# EAGLE design Jumbo Programmer (EAGLE 7.7.0)
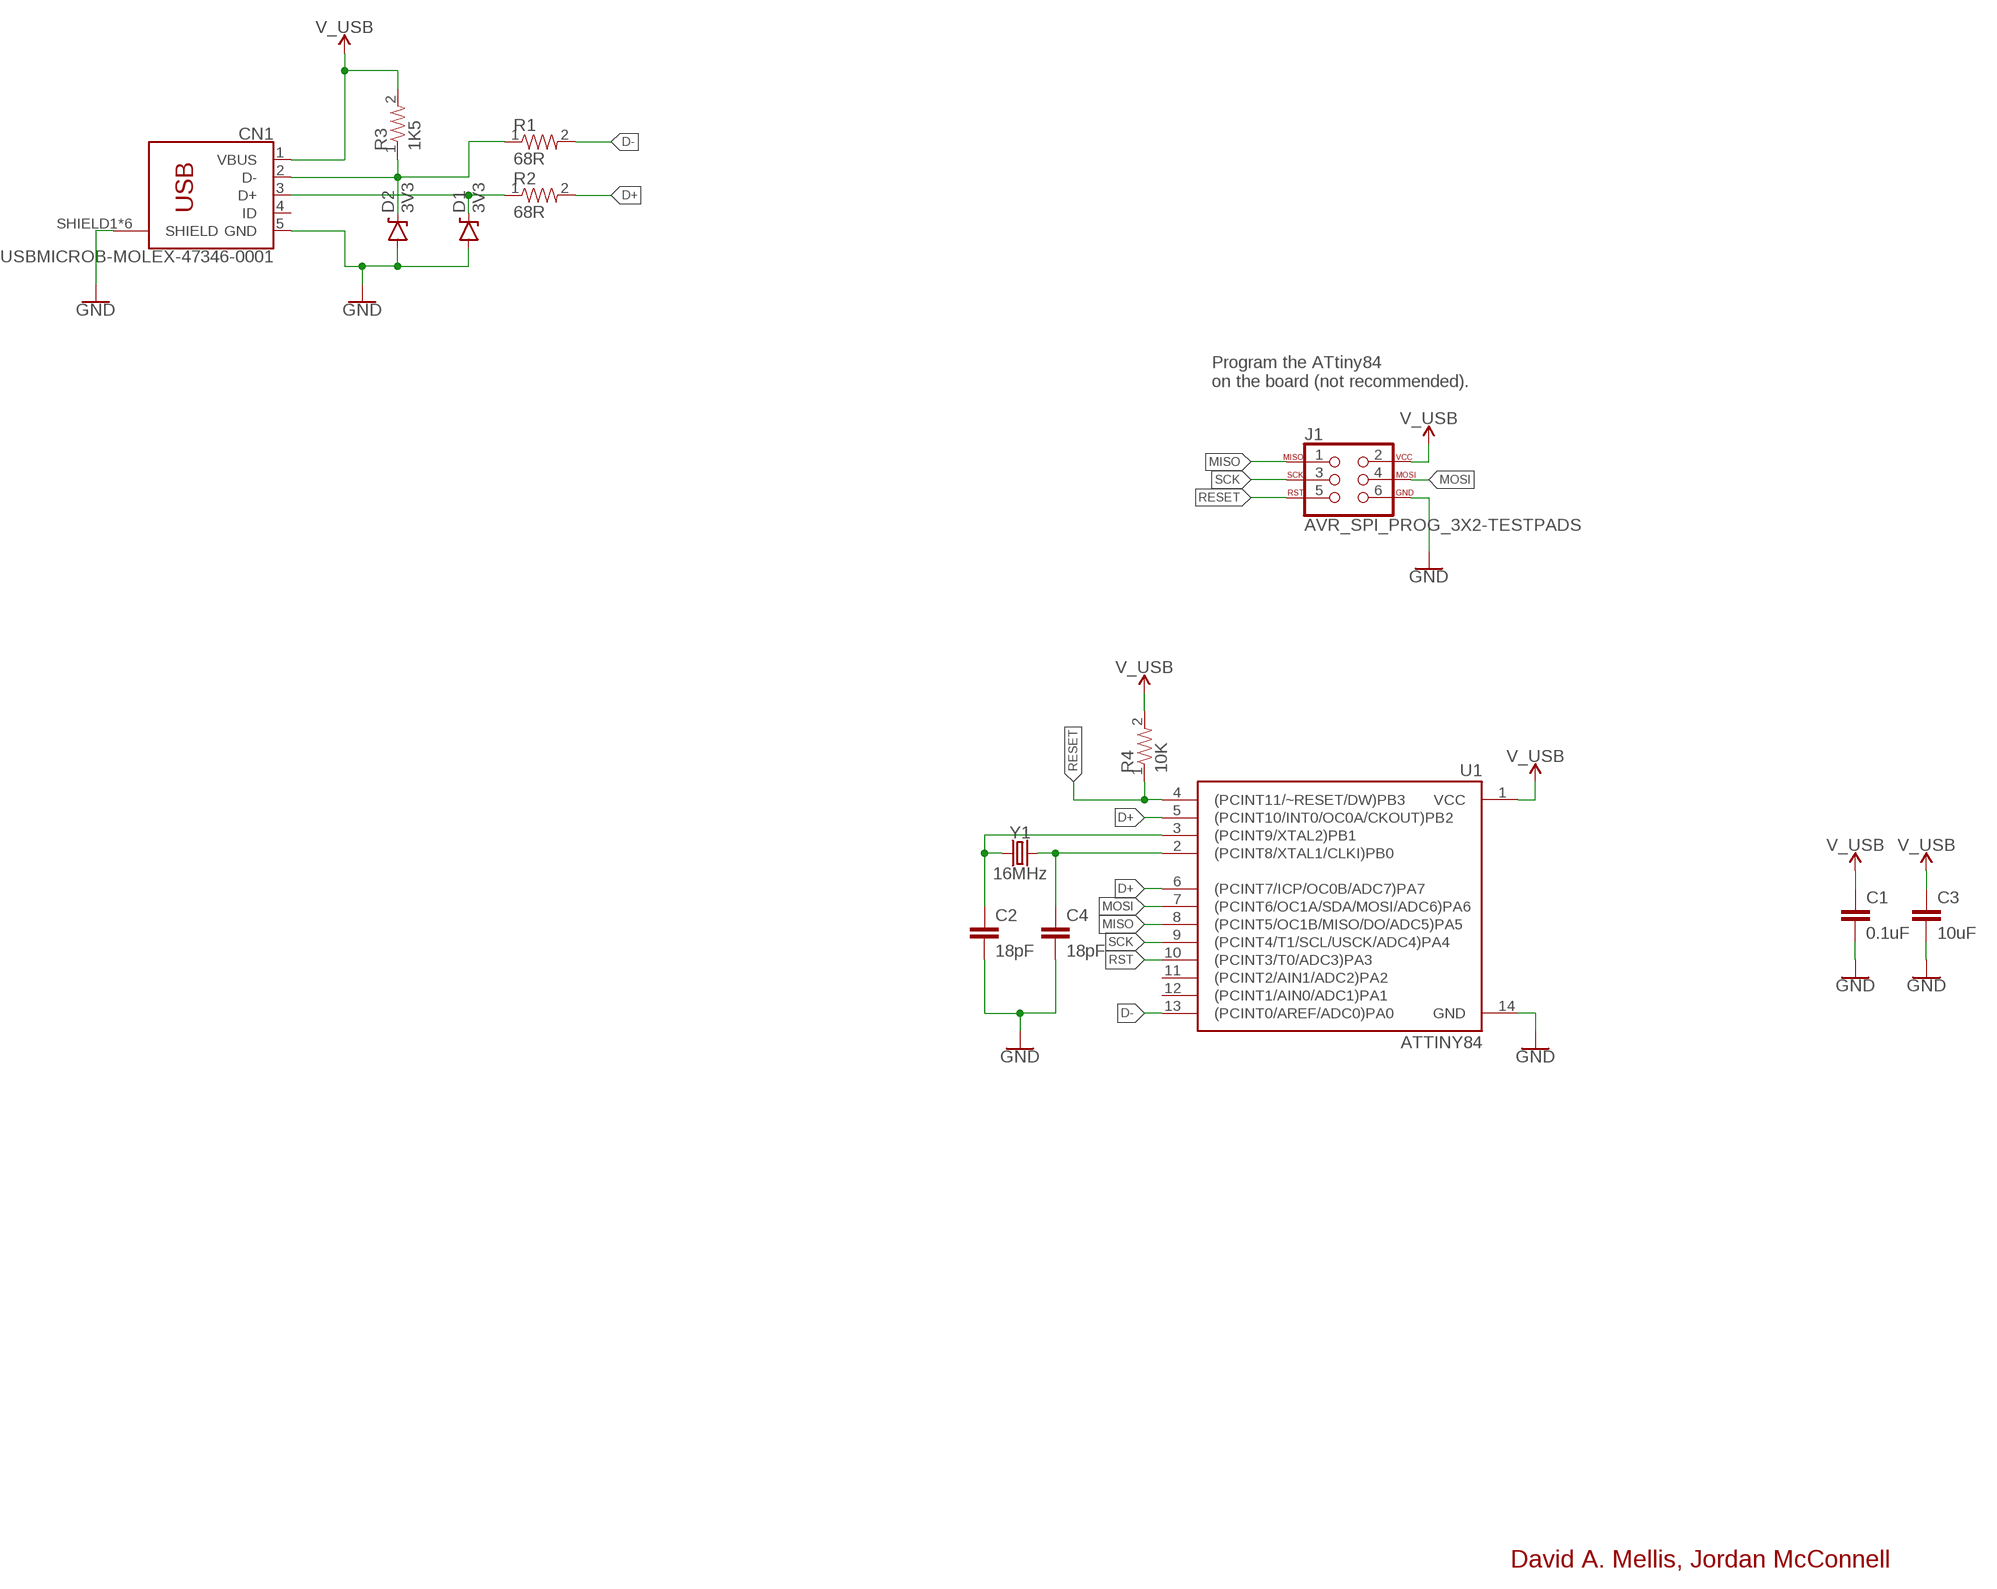
[diagram p0: schematic, sheet 1, part 1 of 2]
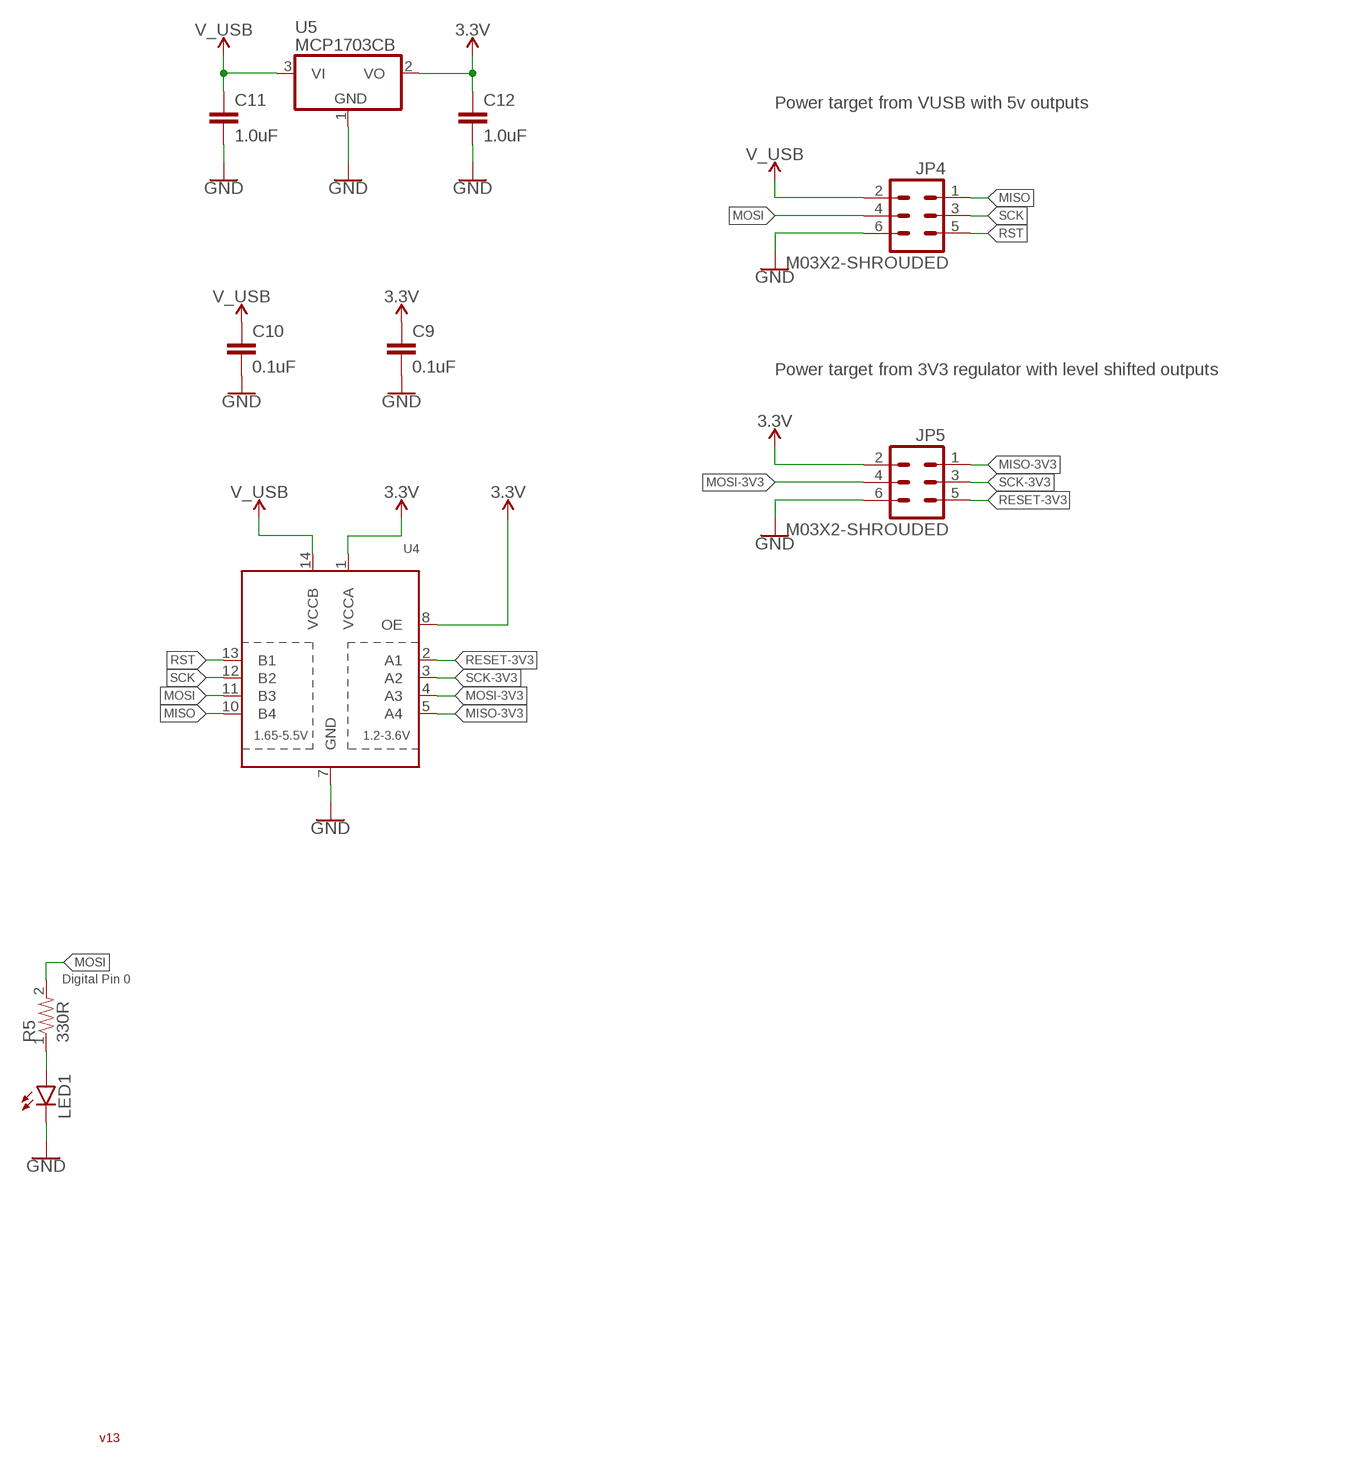
[diagram p1: schematic, sheet 1, part 2 of 2]

## Parts
C1  0.1uF  CAPACITOR-0603  [0603-CAP]
C2  18pF  CAPACITOR-0603  [0603-CAP]
C3  10uF  CAPACITOR-0603  [0603-CAP]
C4  18pF  CAPACITOR-0603  [0603-CAP]
C9  0.1uF  CAPACITOR-0603  [0603-CAP]
C10  0.1uF  CAPACITOR-0603  [0603-CAP]
C11  1.0uF  CAPACITOR-0603  [0603-CAP]
C12  1.0uF  CAPACITOR-0603  [0603-CAP]
CN1  USBMICROB-MOLEX-47346-0001  [MOLEX_47346-0001]
D1  3V3  DIODE-ZENER-SOD-323  [SOD-323]
D2  3V3  DIODE-ZENER-SOD-323  [SOD-323]
J1  AVR_SPI_PROG_3X2-TESTPADS  [2X3_TEST_PADS]
JP4  M03X2-SHROUDED  [2X3-SHROUDED-B]
JP5  M03X2-SHROUDED  [2X3-SHROUDED-B]
LED1  LED0603  [LED-0603]
R1  68R  RESISTOR-0603  [0603-RES]
R2  68R  RESISTOR-0603  [0603-RES]
R3  1K5  RESISTOR-0603  [0603-RES]
R4  10K  RESISTOR-0603  [0603-RES]
R5  330R  RESISTOR-0603  [0603-RES]
U1  ATTINY84  [SO14]
U4  TXB0104PWR  [TSSOP14]
U5  MCP1703CB  [SOT23]
Y1  16MHz  CRYSTAL-16MHZSMD-5X3.2  [CRYSTAL-SMD-5X3.2-4PAD]

## Nets
3.3V: C9.1 C12.1 JP5.2 U4.1(VCCA) U4.8(OE) U5.2(VO)
D+: R2.2 U1.5((PCINT10/INT0/OC0A/CKOUT)PB2) U1.6((PCINT7/ICP/OC0B/ADC7)PA7)
D-: R1.2 U1.13((PCINT0/AREF/ADC0)PA0)
GND: C1.2 C2.2 C3.2 C4.2 C9.2 C10.2 C11.2 C12.2 CN1.5(GND) CN1.SHIELD1(SHIELD) CN1.SHIELD2(SHIELD) CN1.SHIELD3(SHIELD) CN1.SHIELD4(SHIELD) CN1.SHIELD5(SHIELD) CN1.SHIELD6(SHIELD) D1.A D2.A J1.6 JP4.6 JP5.6 LED1.C U1.14(GND) U4.7(GND) U5.1(GND)
MISO: J1.1 JP4.1 U1.8((PCINT5/OC1B/MISO/DO/ADC5)PA5) U4.10(B4)
MISO-3V3: JP5.1 U4.5(A4)
MOSI: J1.4 JP4.4 R5.2 U1.7((PCINT6/OC1A/SDA/MOSI/ADC6)PA6) U4.11(B3)
MOSI-3V3: JP5.4 U4.4(A3)
N$1: CN1.2(D-) D2.C R1.1 R3.1
N$2: CN1.3(D+) D1.C R2.1
N$3: C2.1 U1.3((PCINT9/XTAL2)PB1) Y1.1
N$4: C4.1 U1.2((PCINT8/XTAL1/CLKI)PB0) Y1.3
N$5: LED1.A R5.1
RESET: J1.5 R4.1 U1.4((PCINT11/~RESET/DW)PB3)
RESET-3V3: JP5.5 U4.2(A1)
RST: JP4.5 U1.10((PCINT3/T0/ADC3)PA3) U4.13(B1)
SCK: J1.3 JP4.3 U1.9((PCINT4/T1/SCL/USCK/ADC4)PA4) U4.12(B2)
SCK-3V3: JP5.3 U4.3(A2)
V_USB: C1.1 C3.1 C10.1 C11.1 CN1.1(VBUS) J1.2 JP4.2 R3.2 R4.2 U1.1(VCC) U4.14(VCCB) U5.3(VI)
Unconnected: CN1.4(ID) U1.11((PCINT2/AIN1/ADC2)PA2) U1.12((PCINT1/AIN0/ADC1)PA1)

## Notes on the sheet
- Power target from VUSB with 5v outputs
- Program the ATtiny84
  on the board (not recommended).
- Power target from 3V3 regulator with level shifted outputs
- Digital Pin 0
- v13
- David A. Mellis, Jordan McConnell

## Library data of the parts
C1-C4 C9-C12 = Darryl-Capacitors:CAPACITOR: Capacitor
CN1 = Connectors:USBMICROB
D1 D2 = Darryl-DiscreteSemi:DIODE-ZENER
J1 = Connectors:AVR_SPI_PROG_3X2: AVR ISP 6 Pin This is the reduced ISP connector for AVR programming. Common on Arduino. This footprint will take up less PCB space and can be used with a 10-pin to 6-pin adapter such as SKU: BOB-08508 **Special note about "TEST_POINT" package. The stop mask is on the top side, so if you want your programming test points to be on the bottom of your board, make sure to place this package on the bottom side of the board. This also ensure that the orientation to program from the bottom side will be correct. SparkFun Products: SparkFun ISP Pogo Adapter <https://www.sparkfun.com/products/11591> - NS Tiny AVR Programmer <https://www.sparkfun.com/products/11801> -PTH
JP4 JP5 = Darryl:M03X2
LED1 = Darryl:LED: LEDs Standard schematic elements and footprints for 5mm, 3mm, 1206, and 0603 sized LEDs. 5mm - Spark Fun Electronics SKU : COM-00529 (and others)
R1-R5 = Darryl-Resistors:RESISTOR
U1 = SparkFun-DigitalIC:ATTINY84: Atmel 14-pin 2/4/8kB flash uC
U4 = adafruit:TXB0104PWR: 4-Bit Bi-Directional Level Shifter 1.2V-3.6V (VCCA) to 1.65V-5.5V (VCCB) bi-directional level shifter with auto direction sensing. Max data rate - VCCA 1.8V: 20Mbps (50ns), VCCA 3.3V: 100Mbps (10ns) Digikey: 296-21929-1-ND
U5 = linear:MCP1703: 250 mA, 16V, Low Quiescent Current LDO Regulator Source: http://ww1.microchip.com/downloads/en/DeviceDoc/22049b.pdf
Y1 = SparkFun-Clocks:CRYSTAL-16MHZ: 16MHz Crystal Digikey Example <http://www.digikey.com/product-search/en?keywords=535-9122-1-ND> Frequency: 16MHz Frequency Stability: ±50ppm Frequency Tolerance: ±20ppm Load Capacitance: 18pF SparkFun Products: Pro Micro -5V/16MHz <https://www.sparkfun.com/products/12640> SparkFun Serial Enabled LCD Kit <https://www.sparkfun.com/products/10097>; PROD_ID: XTAL-08218; SF_ID: COM-00094

## Board
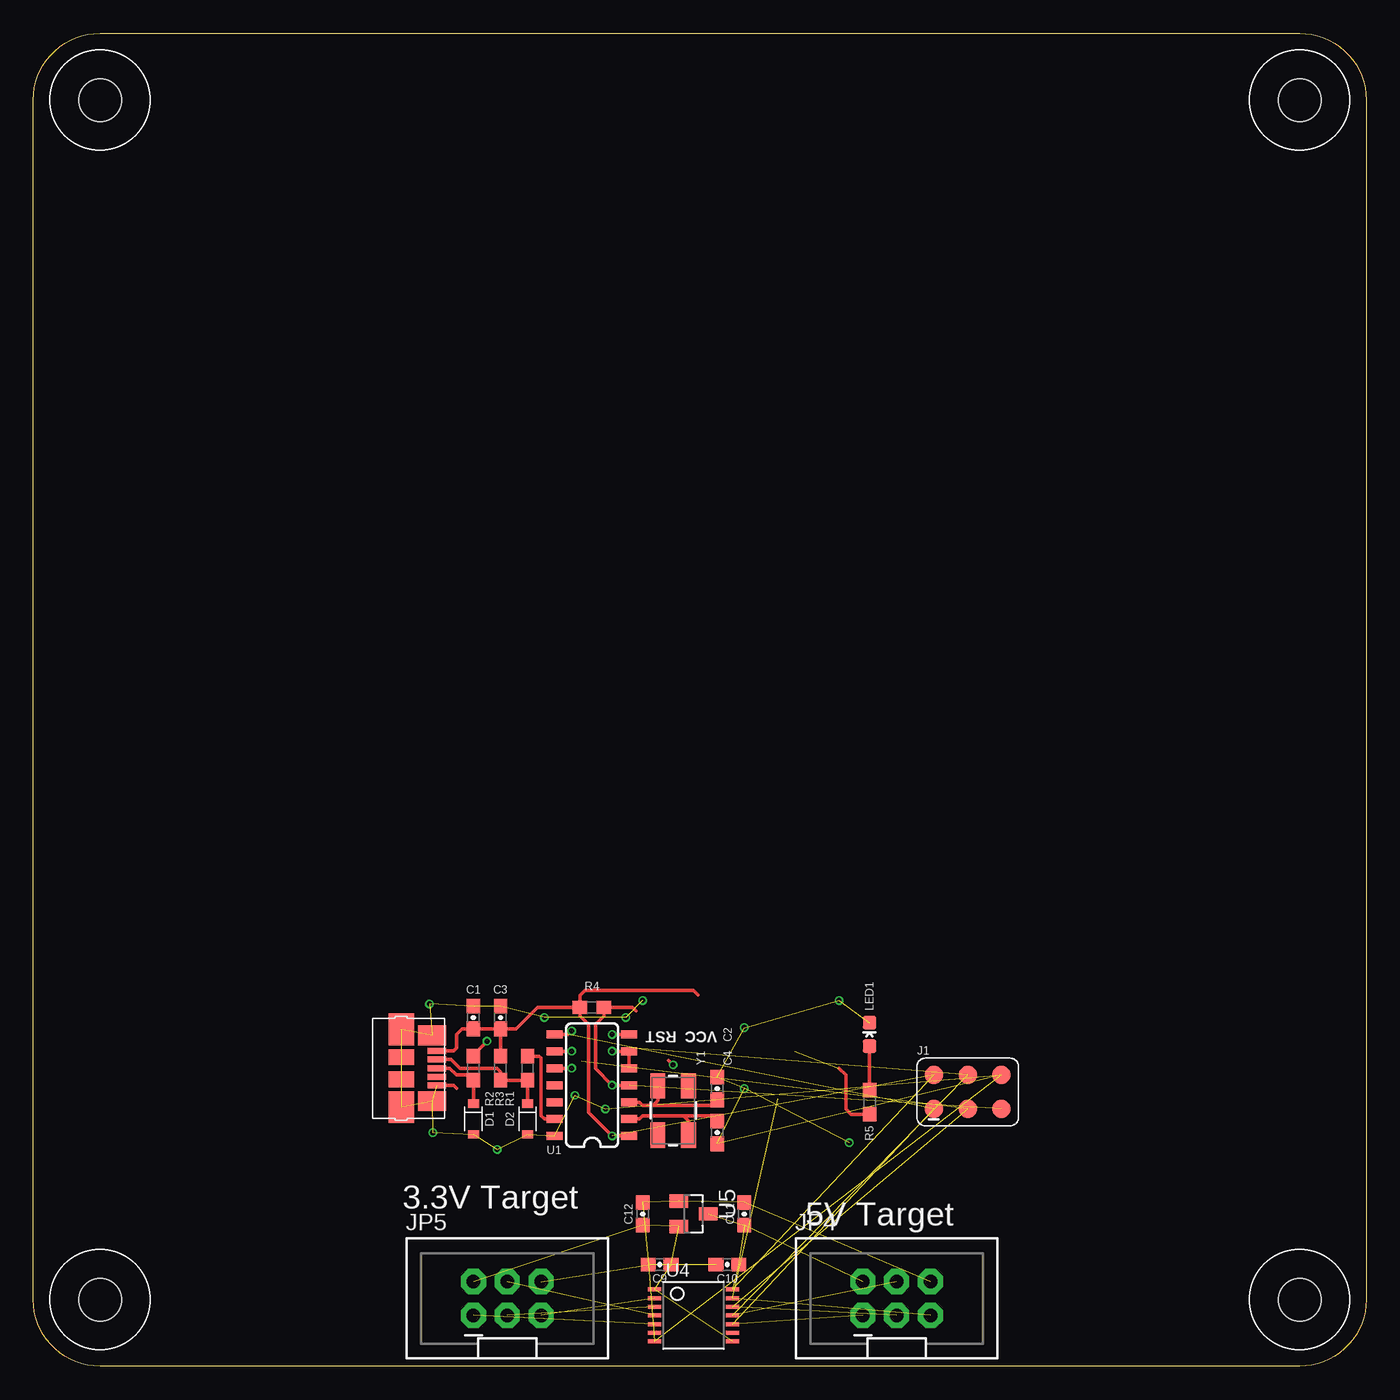
[diagram p2: board, top side]
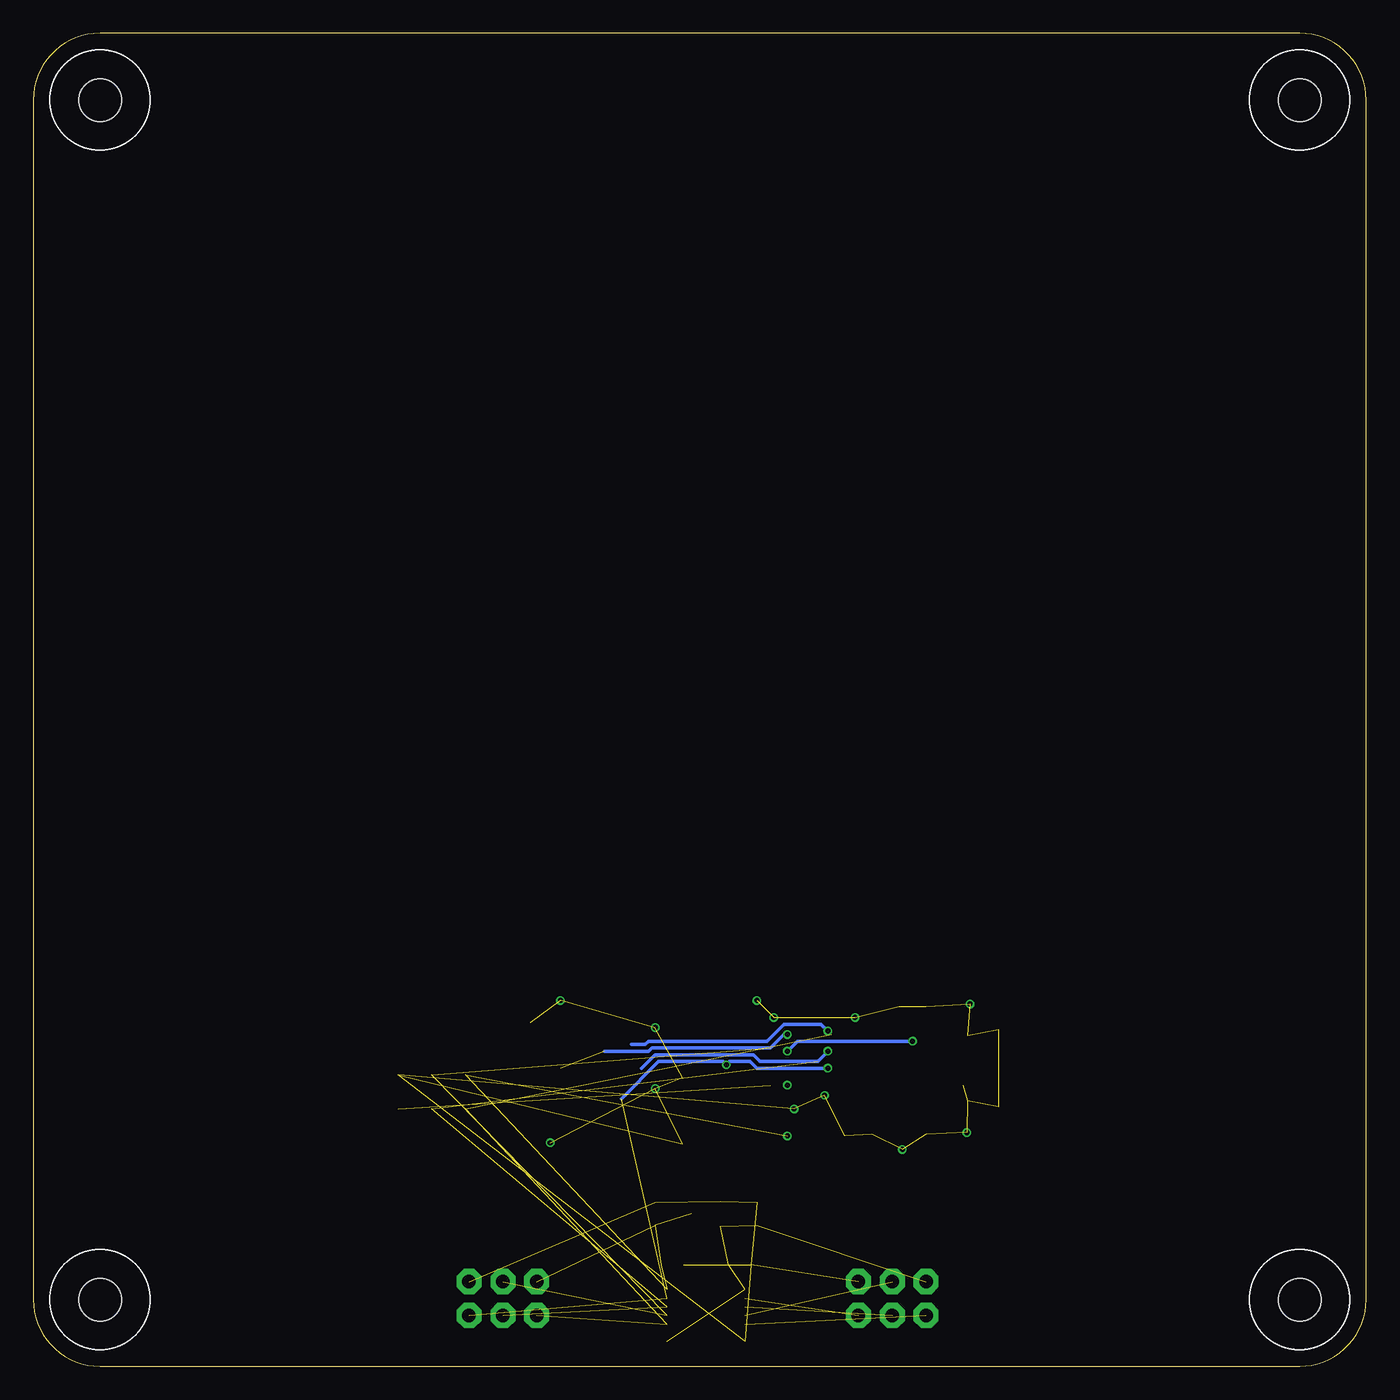
[diagram p3: board, bottom side, seen from below]

Size 100 x 100 mm. Coordinates in mm from the lower left corner, seen from the top.
Copper layers (1*16): Top 0.035559375mm / dielectric 1.6mm / Bottom 0.035559375mm
Design rules "oshpark-2layer *": minimum track width 6mil, minimum drill 10mil, track to track 6mil, track to pad 6mil, pad to pad 6mil, via to via 6mil, smd to smd 6mil, copper to edge 15mil, drill to drill 6mil, minimum pad ring 5mil, minimum via ring 5mil, stop-mask expansion 2.5mil, vias tented up to drill 20mil, thermal gap 10mil

### Footprints (pad centres in the part's own frame; a part is rotated, then mirrored left to right if it is on the bottom)
0603-CAP = smd 1.1 x 1: 1 -0.85,0; 2 0.85,0
MOLEX_47346-0001 = smd 1.38 x 0.45: 1 4.11,1.3; 2 4.11,0.65; 3 4.11,0; 4 4.11,-0.65; 5 4.11,-1.3 | smd 1.9 x 2.375: SHIELD1 1.45,2.913; SHIELD6 1.45,-2.913 | smd 2.1 x 1.475: SHIELD2 3.75,2.462; SHIELD5 3.75,-2.462 | smd 1.9 x 1.175: SHIELD3 1.45,0.838; SHIELD4 1.45,-0.838
SOD-323 = smd 0.63 x 0.83: A 1.15,0; C -1.15,0
2X3_TEST_PADS = smd 1.397 x 1.397: 1 -2.54,-1.27; 2 -2.54,1.27; 3 0,-1.27; 4 0,1.27; 5 2.54,-1.27; 6 2.54,1.27
2X3-SHROUDED-B = drill 1.016 pad 1.88 octagon: 1 -2.54,-1.27; 2 -2.54,1.27; 3 0,-1.27; 4 0,1.27; 5 2.54,-1.27; 6 2.54,1.27
LED-0603 = smd 1 x 1: A 0,-0.877; C 0,0.877
10X10CM = hole 3.2: 5,95; 95,95; 5,5; 95,5
0603-RES = smd 1.1 x 1: 1 -0.9,0; 2 0.9,0
SO14 = smd 0.6 x 1.2: 1 -3.81,-2.8; 2 -2.54,-2.8; 3 -1.27,-2.8; 4 0,-2.8; 5 1.27,-2.8; 6 2.54,-2.8; 7 3.81,-2.8; 8 3.81,2.8; 9 2.54,2.8; 10 1.27,2.8; 11 0,2.8; 12 -1.27,2.8; 13 -2.54,2.8; 14 -3.81,2.8
TSSOP14 = smd 0.305 x 0.991: 1 -1.95,-2.918; 2 -1.3,-2.918; 3 -0.65,-2.918; 4 0,-2.918; 5 0.65,-2.918; 6 1.3,-2.918; 7 1.95,-2.918; 8 1.95,2.918; 9 1.3,2.918; 10 0.65,2.918; 11 0,2.918; 12 -0.65,2.918; 13 -1.3,2.918; 14 -1.95,2.918
SOT23 = smd 1 x 1.4: 1 -0.95,-1.1; 2 0.95,-1.1; 3 0,1.1
CRYSTAL-SMD-5X3.2-4PAD = smd 1.9 x 1.1: 1 -1.85,-1.15; 2 1.85,-1.15; 3 1.85,1.15; 4 -1.85,1.15

### Placement (x,y rotation side)
C1  33.02,26.16 90 top
C2  51.31,20.83 90 top
C3  35.05,26.16 90 top
C4  51.31,17.53 270 top
C9  46.99,7.62 180 top
C10  52.07,7.62 180 top
C11  53.34,11.43 90 top
C12  45.72,11.43 90 top
CN1  26.16,22.35 0 top
D1  33.02,18.54 270 top
D2  37.08,18.54 270 top
J1  70.1,20.57 0 top
JP4  64.77,5.08 0 top
JP5  35.56,5.08 0 top
LED1  62.74,24.89 0 top
PCB1  [10X10CM]  0,0 0 top
R1  37.08,22.35 90 top
R2  33.02,22.35 90 top
R3  35.05,22.35 90 top
R4  41.91,26.92 180 top
R5  62.74,19.81 270 top
U1  41.91,21.08 90 top
U4  49.53,3.81 270 top
U5  49.53,11.43 270 top
Y1  48.01,19.18 270 top

### Tracks (layer width: path | path; a pad name or v marks a point on that pad's centre or on a via)
3.3V  (5 unrouted)
D+  (via drill 0.38)
  Top 0.254: R2.2 33.02,23.37 v34.04,24.38 | v43.43,23.62 U1.6 U1.5
  Bottom 0.254: v34.04,24.38 42.67,24.38 v43.43,23.62
D-
  Top 0.254: R1.2 37.96,23.25 38.1,23.11 38.1,18.8 38.35,18.54 U1.13
GND  (via drill 0.38)  (35 unrouted)
  Top 0.254: CN1.5 31.53,21.05 31.75,20.83
  other vias: 38.35,26.16 44.45,26.16 45.72,27.43 40.64,20.32 42.93,19.3 60.45,27.43 61.21,16.76 53.34,25.4 53.34,20.83 34.8,16.26 29.97,17.53 29.72,27.18
MISO  (via drill 0.38)  (3 unrouted)
  Top 0.254: U1.8 40.13,24.89 v40.39,25.15
  Bottom 0.254: 55.12,24.13 54.1,24.13 53.85,24.38 44.96,24.38 43.69,25.65 40.89,25.65 v40.39,25.15
MISO-3V3  (1 unrouted)
MOSI  (via drill 0.38)  (4 unrouted)
  Top 0.254: U1.7 v43.43,24.89 | R5.2 61.35,18.91 60.96,19.3 60.96,21.84 60.45,22.35
  Bottom 0.254: 57.15,23.62 53.85,23.62 53.59,23.88 44.7,23.88 43.69,24.89 v43.43,24.89
MOSI-3V3  (1 unrouted)
N$1
  Top 0.254: CN1.2 31.35,23 32,22.35 34.8,22.35 35.05,22.1 R3.1 R1.1 D2.C
N$2
  Top 0.254: D1.C R2.1 32.63,21.84 31.75,21.84 31.24,22.35 CN1.3
N$3
  Top 0.254: U1.3 45.47,19.81 45.72,19.56 46.48,19.56 | 46.48,19.56 50.89,19.56 C2.1 | Y1.1 46.86,19.93 46.48,19.56
N$4
  Top 0.254: U1.2 45.47,18.54 45.72,18.8 48.77,18.8 | 48.77,18.8 50.89,18.8 C4.1 | Y1.3 49.16,18.41 48.77,18.8
N$5
  Top 0.254: R5.1 LED1.A
RESET  (via drill 0.38)  (1 unrouted)
  Top 0.254: U1.4 v43.43,21.08 42.16,22.35 42.16,25.65 42.81,26.3 R4.1 44.96,26.92 45.21,26.67
RESET-3V3  (1 unrouted)
RST  (via drill 0.38)  (2 unrouted)
  Top 0.254: U1.10 v40.39,22.35 | 47.65,22.96 v48.01,22.61
  Bottom 0.254: 55.88,20.07 53.09,22.86 48.26,22.86 v48.01,22.61 47.75,22.86 46.23,22.86 45.72,22.35 v40.39,22.35
SCK  (via drill 0.38)  (3 unrouted)
  Top 0.254: U1.9 v40.39,23.62
  Bottom 0.254: 54.36,22.35 53.34,23.37 45.97,23.37 45.47,22.86 41.15,22.86 v40.39,23.62
SCK-3V3  (1 unrouted)
V_USB  (via drill 0.38)  (6 unrouted)
  Top 0.254: C3.1 C1.1 32.17,25.31 31.75,24.89 31.75,23.88 31.53,23.65 CN1.1 | C3.1 R3.2 | C3.1 36.23,25.31 37.85,26.92 R4.2 | U1.1 v43.43,17.27 41.66,19.05 41.66,25.65 41.01,26.3 R4.2 | 49.89,27.84 49.53,28.19 41.4,28.19 41.01,27.8 R4.2

### Text on the board
tPlace: RST | VCC
tNames: 3.3V Target | 5V Target